# Altium schematic sheet Teeth_Radiology_SCH.SchDoc
size C
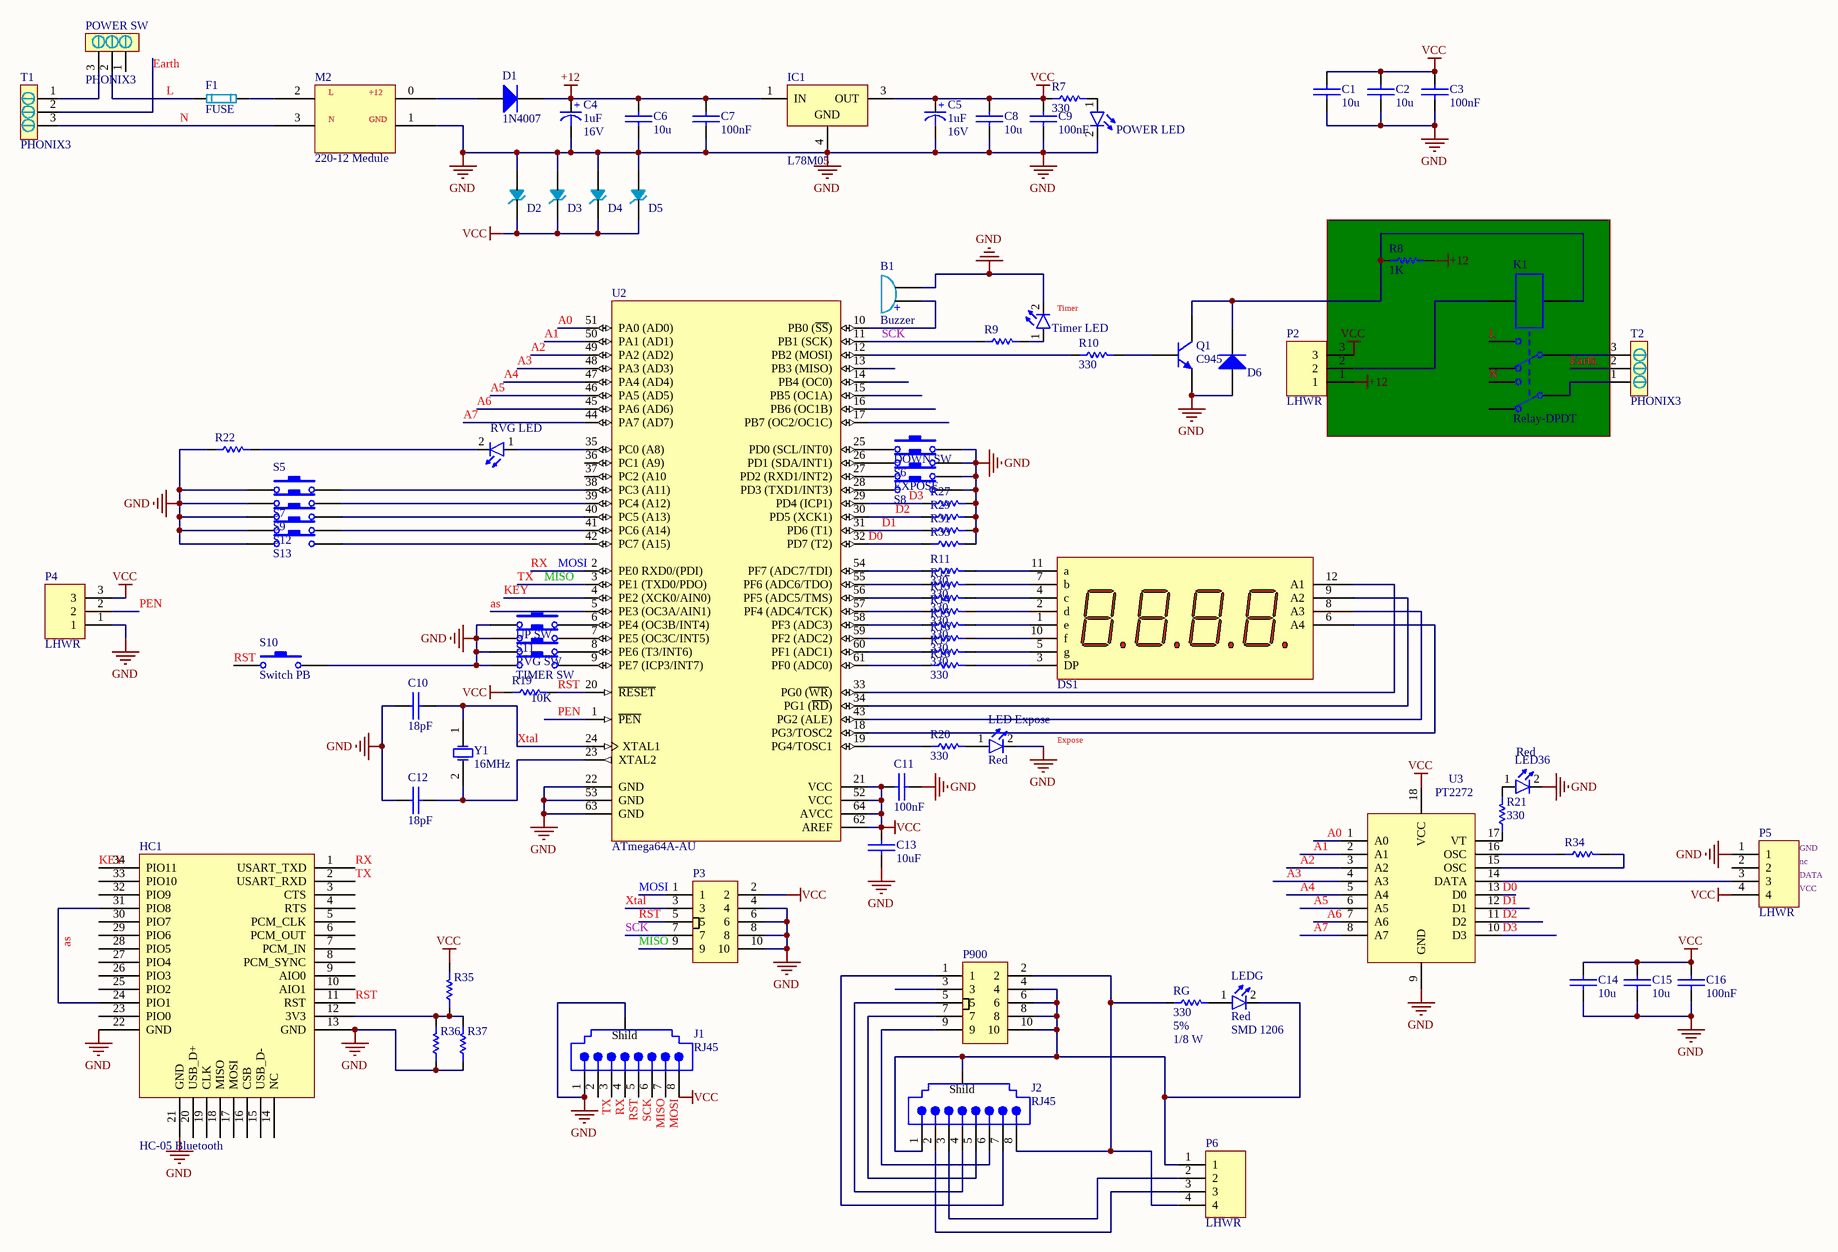
[diagram p0: Teeth_Radiology_SCH.SchDoc]

## Parts
B1  Buzzer  [Buzzer]
C1  10u  [SMD_CAP_1206]
C2  10u  [SMD_CAP_1206]
C3  100nF  [SMD_CAP_1206]
C4  Voltage: 16V  [cap 04]  (hidden comment: 1uF)
C5  Voltage: 16V  [cap 04]  (hidden comment: 1uF)
C6  10u  [SMD_CAP_1206]
C7  100nF  [SMD_CAP_1206]
C8  10u  [SMD_CAP_1206]
C9  100nF  [SMD_CAP_1206]
C10  18pF  [SMD_CAP_0805]
C11  100nF  [SMD_CAP_0805]
C12  18pF  [SMD_CAP_0805]
C13  10uF  [SMD_CAP_1206]
C14  10u  [SMD_CAP_1206]
C15  10u  [SMD_CAP_1206]
C16  100nF  [SMD_CAP_1206]
D1  1N4007  [My_DO-41]
D2  Diode Zener SMD  [DIOMELF3615N]  (value not drawn)
D3  Diode Zener SMD  [DIOMELF3615N]  (value not drawn)
D4  Diode Zener SMD  [DIOMELF3615N]  (value not drawn)
D5  Diode Zener SMD  [DIOMELF3615N]  (value not drawn)
D6  1N4007  [My_DO-41]  (value not drawn)
DOWN_SW  Switch PB  [Switch - Push to On]  (value not drawn)
DS1  7Segment-4Digit-CA  [7segCA]  (value not drawn)
EXPOSE  Switch PB  [Switch - Push to On]  (value not drawn)
F1  FUSE  [FUSE_1]
HC1  HC-05 Bluetooth  [HC-05]
IC1  L78M05  [TO-252]
J1  RJ45  [My_RJ45]
J2  RJ45  [My_RJ45]
K1  Relay-DPDT  [My_REL_cochick]
LED36  Red  [LED-3mm]
LED_Expose  Red  [LED-3mm]
LEDG  Size: SMD 1206  [LED-3mm]  (hidden comment: Red)
M2  220-12 Medule  [AC-DC 220-12]
P2  LHWR  [Polarized Header 3]
P3  BoxHeader 2x5  [Box Header 2x5]  (value not drawn)
P4  LHWR  [Polarized Header 3]
P5  LHWR  [Polarized Header 4]
P6  LHWR  [Polarized Header 4]
P900  BoxHeader 2x5  [Box Header 2x5]  (value not drawn)
POWER_LED  Red  [LED-3mm]  (value not drawn)
POWER_SW  PHONIX3  [PHONIX3]
Q1  C945  [C945]
R7  330  [RES 0805 (2012X06L)]
R8  1K  [RES 0805 (2012X06L)]
R9  330  [RES 0805 (2012X06L)]  (value not drawn)
R10  330  [RES 0805 (2012X06L)]
R11  330  [RES 0805 (2012X06L)]
R12  330  [RES 0805 (2012X06L)]
R13  330  [RES 0805 (2012X06L)]
R14  330  [RES 0805 (2012X06L)]
R15  330  [RES 0805 (2012X06L)]
R16  330  [RES 0805 (2012X06L)]
R17  330  [RES 0805 (2012X06L)]
R18  330  [RES 0805 (2012X06L)]
R19  10K  [RES 0805 (2012X06L)]
R20  330  [RES 0805 (2012X06L)]
R21  330  [RES 0805 (2012X06L)]
R22  330  [RES 0805 (2012X06L)]  (value not drawn)
R27  1K  [RES 0805 (2012X06L)]  (value not drawn)
R29  1K  [RES 0805 (2012X06L)]  (value not drawn)
R31  1K  [RES 0805 (2012X06L)]  (value not drawn)
R33  1K  [RES 0805 (2012X06L)]  (value not drawn)
R34  820k  [RES 0805 (2012X06L)]  (value not drawn)
R35  51k  [RES 0805 (2012X06L)]  (value not drawn)
R36  100k  [RES 0805 (2012X06L)]  (value not drawn)
R37  100k  [RES 0805 (2012X06L)]  (value not drawn)
RG  Tolerance: 5%  Power: 1/8 W  [RES 0805 (2012X06L)]  (hidden comment: 330)
RVG_LED  Red  [LED-3mm]  (value not drawn)
RVG_SW  Switch PB  [Switch - Push to On]  (value not drawn)
S5  Switch PB  [Switch - Push to On]  (value not drawn)
S6  Switch PB  [Switch - Push to On]  (value not drawn)
S7  Switch PB  [Switch - Push to On]  (value not drawn)
S8  Switch PB  [Switch - Push to On]  (value not drawn)
S9  Switch PB  [Switch - Push to On]  (value not drawn)
S10  Switch PB  [Switch - Push to On]
S11  Switch PB  [Switch - Push to On]  (value not drawn)
S12  Switch PB  [Switch - Push to On]  (value not drawn)
S13  Switch PB  [Switch - Push to On]  (value not drawn)
T1  PHONIX3  [PHONIX3]
T2  PHONIX3  [PHONIX3]
Timer_LED  Red  [LED-3mm]  (value not drawn)
TIMER_SW  Switch PB  [Switch - Push to On]  (value not drawn)
U2  ATmega64A-AU  [64A_M]
U3  PT2272  [DIP18]
UP_SW  Switch PB  [Switch - Push to On]  (value not drawn)
Y1  16MHz  [XTAL Small]

## Nets
+12: C4.1(+) C6.1(+) C7.1(+) D1.K IC1.1(IN) P2.1 R8.2
GND: B1.2(GND) C1.2(-) C2.2(-) C3.2(-) C4.2(-) C5.2(-) C6.2(-) C7.2(-) C8.2(-) C9.2(-) C10.1(+) C11.1(+) C12.1(+) C13.2(-) C14.2(-) C15.2(-) C16.2(-) D2.2 D3.2 D4.2 D5.2 D6.A DOWN_SW.2 EXPOSE.2 HC1.13(GND) HC1.21(GND) HC1.22(GND) IC1.4(GND) J1.1 J1.shild(Shild) LED36.2(K) LED_Expose.2(K) M2.1 P3.4 P3.6 P3.8 P3.10 P4.1 P5.1 POWER_LED.2(K) Q1.1(E) R22.1 R27.2 R29.2 R31.2 R33.2 R36.1 R37.1 RVG_SW.1 S5.1 S6.2 S7.1 S8.2 S9.1 S10.2 S11.1 S12.1 S13.1 Timer_LED.2(K) TIMER_SW.1 U2.22(GND) U2.53(GND) U2.63(GND) U3.9(GND) UP_SW.1
VCC: C1.1(+) C2.1(+) C3.1(+) C5.1(+) C8.1(+) C9.1(+) C11.2(-) C13.1(+) C14.1(+) C15.1(+) C16.1(+) D2.1 D3.1 D4.1 D5.1 IC1.3(OUT) J1.8 P2.3 P3.2 P4.3 P5.4 R7.1 R19.1 R35.2 U2.21(VCC) U2.52(VCC) U2.62(AREF) U2.64(AVCC) U3.18(VCC)
A0: U2.51(PA0_(AD0)) U3.1(A0)
A1: U2.50(PA1_(AD1)) U3.2(A1)
A2: U2.49(PA2_(AD2)) U3.3(A2)
A3: U2.48(PA3_(AD3)) U3.4(A3)
A4: U2.47(PA4_(AD4)) U3.5(A4)
A5: U2.46(PA5_(AD5)) U3.6(A5)
A6: U2.45(PA6_(AD6)) U3.7(A6)
A7: U2.44(PA7_(AD7)) U3.8(A7)
as: HC1.24(PIO1) HC1.31(PIO8) U2.5(PE3_(OC3A/AIN1))
D0: R33.1 U2.32(PD7_(T2)) U3.13(D0)
D1: R31.1 U2.31(PD6_(T1)) U3.12(D1)
D2: R29.1 U2.30(PD5_(XCK1)) U3.11(D2)
D3: R27.1 U2.29(PD4_(ICP1)) U3.10(D3)
Earth: T1.2 T2.2
KEY: HC1.34(PIO11) U2.4(PE2_(XCK0/AIN0))
L: F1.1 K1.S1 POWER_SW.2
MISO: HC1.2(USART_RXD) J1.2 J1.6 P3.9 U2.3(PE1_(TXD0/PDO))  [also labelled TX]
MOSI: HC1.1(USART_TXD) J1.3 J1.7 P3.1 U2.2(PE0_RXD0/(PDI))  [also labelled RX]
N: K1.S2 M2.3 T1.3
PEN: P4.2 U2.1(~{PEN})
RST: HC1.11(RST) J1.4 P3.5 R19.2 S10.1 U2.20(~{RESET})
SCK: J1.5 P3.7 R9.1 U2.11(PB1_(SCK))
Xtal: C10.2(-) P3.3 U2.24(XTAL1) Y1.1(OSC1)
NetB1_1: B1.1(VCC) U2.10(PB0_(~{SS}))
NetC12_2: C12.2(-) U2.23(XTAL2) Y1.2(OSC2)
NetD1_A: D1.A M2.0
NetD6_K: D6.K K1.1 Q1.2(C) R8.1
NetDOWN_SW_1: DOWN_SW.1 U2.25(PD0_(SCL/INT0))
NetDS1_1: DS1.1(e) R15.2
NetDS1_2: DS1.2(d) R14.2
NetDS1_3: DS1.3(DP) R18.2
NetDS1_4: DS1.4(c) R13.2
NetDS1_5: DS1.5(g) R17.2
NetDS1_6: DS1.6(A4) U2.18(PG3/TOSC2)
NetDS1_7: DS1.7(b) R12.2
NetDS1_8: DS1.8(A3) U2.43(PG2_(ALE))
NetDS1_9: DS1.9(A2) U2.34(PG1_(~{RD}))
NetDS1_10: DS1.10(f) R16.2
NetDS1_11: DS1.11(a) R11.2
NetDS1_12: DS1.12(A1) U2.33(PG0_(~{WR}))
NetEXPOSE_1: EXPOSE.1 U2.27(PD2_(RXD1/INT2))
NetF1_2: F1.2 M2.2
NetHC1_12: HC1.12(3V3) R35.1 R36.2 R37.2
NetJ2_1: J2.1 J2.shild(Shild) LEDG.2(K) P6.1 P900.4 P900.6 P900.8 P900.10
NetJ2_2: J2.2 P6.3
NetJ2_3: J2.3 P6.2
NetJ2_4: J2.4 P900.5
NetJ2_5: J2.5 P900.7
NetJ2_6: J2.6 P900.9
NetJ2_7: J2.7 P900.1
NetJ2_8: J2.8 P6.4 P900.2 RG.1
NetK1_2: K1.2 P2.2
NetK1_P1: K1.P1 T2.3
NetK1_P2: K1.P2 T2.1
NetLED36_1: LED36.1(A) R21.2
NetLED_Expose_1: LED_Expose.1(A) R20.2
NetLEDG_1: LEDG.1(A) RG.2
NetP5_3: P5.3 U3.14(DATA)
NetPOWER_LED_1: POWER_LED.1(A) R7.2
NetPOWER_SW_3: POWER_SW.3 T1.1
NetQ1_3: Q1.3(B) R10.2
NetR9_2: R9.2 Timer_LED.1(A)
NetR10_1: R10.1 U2.12(PB2_(MOSI))
NetR11_1: R11.1 U2.54(PF7_(ADC7/TDI))
NetR12_1: R12.1 U2.55(PF6_(ADC6/TDO))
NetR13_1: R13.1 U2.56(PF5_(ADC5/TMS))
NetR14_1: R14.1 U2.57(PF4_(ADC4/TCK))
NetR15_1: R15.1 U2.58(PF3_(ADC3))
NetR16_1: R16.1 U2.59(PF2_(ADC2))
NetR17_1: R17.1 U2.60(PF1_(ADC1))
NetR18_1: R18.1 U2.61(PF0_(ADC0))
NetR20_1: R20.1 U2.19(PG4/TOSC1)
NetR21_1: R21.1 U3.17(VT)
NetR22_2: R22.2 RVG_LED.2(K)
NetR34_1: R34.1 U3.16(OSC)
NetR34_2: R34.2 U3.15(OSC)
NetRVG_LED_1: RVG_LED.1(A) U2.35(PC0_(A8))
NetRVG_SW_2: RVG_SW.2 U2.8(PE6_(T3/INT6))
NetS5_2: S5.2 U2.38(PC3_(A11))
NetS6_1: S6.1 U2.26(PD1_(SDA/INT1))
NetS7_2: S7.2 U2.39(PC4_(A12))
NetS8_1: S8.1 U2.28(PD3_(TXD1/INT3))
NetS9_2: S9.2 U2.40(PC5_(A13))
NetS11_2: S11.2 U2.7(PE5_(OC3C/INT5))
NetS12_2: S12.2 U2.41(PC6_(A14))
NetS13_2: S13.2 U2.42(PC7_(A15))
NetTIMER_SW_2: TIMER_SW.2 U2.9(PE7_(ICP3/INT7))
NetU2_6: U2.6(PE4_(OC3B/INT4)) UP_SW.2

Not connected (* = marked no-connect by the designer): HC1 3(CTS) 4(RTS) 5(PCM_CLK) 6(PCM_OUT) 7(PCM_IN) 8(PCM_SYNC) 9(AIO0) 10(AIO1) 14(NC) 15(USB_D-) 16(CSB) 17(MOSI) 18(MISO) 19(CLK) 20(USB_D+) 23(PIO0) 25(PIO2) 26(PIO3) 27(PIO4) 28(PIO5) 29(PIO6) 30(PIO7) 32(PIO9) 33(PIO10); K1 O1 O2; P5 2; P900 3; POWER_SW 1; U2 13(PB3_(MISO)) 14(PB4_(OC0)) 15(PB5_(OC1A)) 16(PB6_(OC1B)) 17(PB7_(OC2/OC1C)) 36(PC1_(A9)) 37(PC2_(A10)

## Notes on the sheet
- (near Timer_LED) Timer
- Expose
- (near P5) GND
- (near P5) nc
- (near P5) DATA
- (near P5) VCC
- (in symbol 220-12 Medule) L; +12; N; GND
- (in symbol Buzzer) +

## Library data of the parts
B1 = Buzzer: Designer: Hamed Jafarzadeh
C1-C3 C6-C16 = Cap-Bipolar: Bipolar Capacitor; Voltage: 100V; Designer: Saeid Jorablo; Organazation: ControTec; Adding Date: 1387/12/20
  C1 C2 C6 C8 C14 C15: Value: 10u
  C3 C7 C9 C11 C16: Value: 100nF
  C10 C12: Value: 18pF
  C13: Value: 10uF
C4 C5 = Cap-Polar: Polar Capacitor; Designer: Saeid Jorablo; Organazation: ControTec; Adding Date: 1387/12/20; Value: 1uF
D1 D6 = 1N4007: 1 Amp Diode
D2-D5 = Diode Zener SMD: Designer: Hamed Jafarzadeh
DOWN_SW EXPOSE RVG_SW S5-S13 TIMER_SW UP_SW = Switch PB: Push Button Switch
DS1 = 7Seg-4Digit-CA: 7-Segment Display: CA; Colour: Read; Designer: Seyed Mohsen Ghasemain; Published: 07/31/2012; Publisher: www.picpars.com; ComponentLink1URL: http://www.picpars.com/
IC1 = L78M05: Precision 500mA Regulator
J1 J2 = RJ45: Right Angle, Standard Profile, RJ45-Keyed, Flange Mount PCB Jack; Ports: 1; Positions/Loaded: Port1 - 8 Keyed/8; PerformanceCategory: 3; PCB_Mounting: Thru-Hole; ComponentAvailability: Obsolete; DrillSize: Nominal, Rounded to nearest 0.05mm; PCB_Layout: Complies with Manufacturer's Recommendation.; Published: 25-Jun-2002; DatasheetDocument: 18-Dec-2001; PackageDocument: 18-Dec-2001; PackageReference: 15-43-6233; Publisher: Altium Limited; ComponentLink1Description: Manufacturer Link; ComponentLink1URL: http://www.molex.com/; ComponentLink2Description: Datasheet; ComponentLink2URL: http://www.molex.com/cmc_upload/common_files/1212003_catalogmx41314.pdf; ComponentLink3Description: Iges Model; ComponentLink3URL: http://www.molex.com/pdm_docs/igs/15-43-6233_igs.zip
K1 = Relay-DPDT: Dual-Pole Dual-Throw Relay; Published: 24-Mar-1999; LatestRevisionDate: 17-Jul-2002; LatestRevisionNote: Re-released for DXP Platform.; PackageReference: DIP-P8; Publisher: Altium Limited
LED36 LED_Expose LEDG POWER_LED RVG_LED Timer_LED = LED: Designer: Saeid Jorablo; Organazation: ControTec; Adding Date: 1387/12/22; Color: Red
  LED36 LED_Expose POWER_LED RVG_LED Timer_LED: Size: SMD 1206
P2 P4 = 3pin LHWR: Designer:: Hamed Jafarzadeh - www.R2T.ir
P3 P900 = BoxHeader 2x5: Designer: HamedJafarzadeh - ww.R2T.ir
P5 P6 = 4pin LHWR: Designer:: Hamed Jafarzadeh - www.R2T.ir
Q1 = C945: NPN Transistor; Designer: Saeid Jorablo; Company: IPA CO; Last Update Time: 2008/08/04; Value: C945
R7-R22 R27 R29 R31 R33-R37 = Resistor: Tolerance: 5%; Power: 1/8 W
  R7 R9-R18 R20-R22: Value: 330
  R8 R27 R29 R31 R33: Value: 1K
  R19: Value: 10K
  R34: Value: 820k
  R35: Value: 51k
  R36 R37: Value: 100k
RG = Resistor: Value: 330
U2 = ATmega64A-AU: 8-bit AVR Microcontroller, 64KB Flash, 2KB EEPROM, 4KB SRAM, 64-pin TQFP, Industrial Grade (-40°C to 85°C); Published: 1-Apr-2010; DatasheetVersion: revC, Jul-2009; PackageVersion: revB, Oct-2001; PackageReference: 64A; Publisher: Altium Limited; PackageDescription: 64-Pin Plastic Thin Profile Quad Flat Pack, 14 x 14 x 1.0 mm Body, 0.8 mm Pitch (TQFP); Supplier 1: Digi-Key; Supplier Part Number 1: ATMEGA64A-AU-ND; Supplier 2: Mouser; Supplier Part Number 2: 556-ATMEGA64A-AU; Code_JEDEC: MS-026-AEB; ComponentLink1Description: Manufacturer Link; ComponentLink1URL: http://www.atmel.com/products/avr/default.asp?; ComponentLink2Description: ATmega64A Datasheet; ComponentLink2URL: http://www.atmel.com/dyn/resources/prod_documents/doc8160.pdf; ComponentLink3Description: ATmega64A Summary; ComponentLink3URL: http://www.atmel.com/dyn/resources/prod_documents/8160S.pdf; ComponentLink4Description: Atmel.com Home; ComponentLink4URL: http://www.atmel.com
Y1 = XTAL: XTAL Crystal; Company: E.P.I.L; Design Date: 11/04/2011; Value: 16MHz